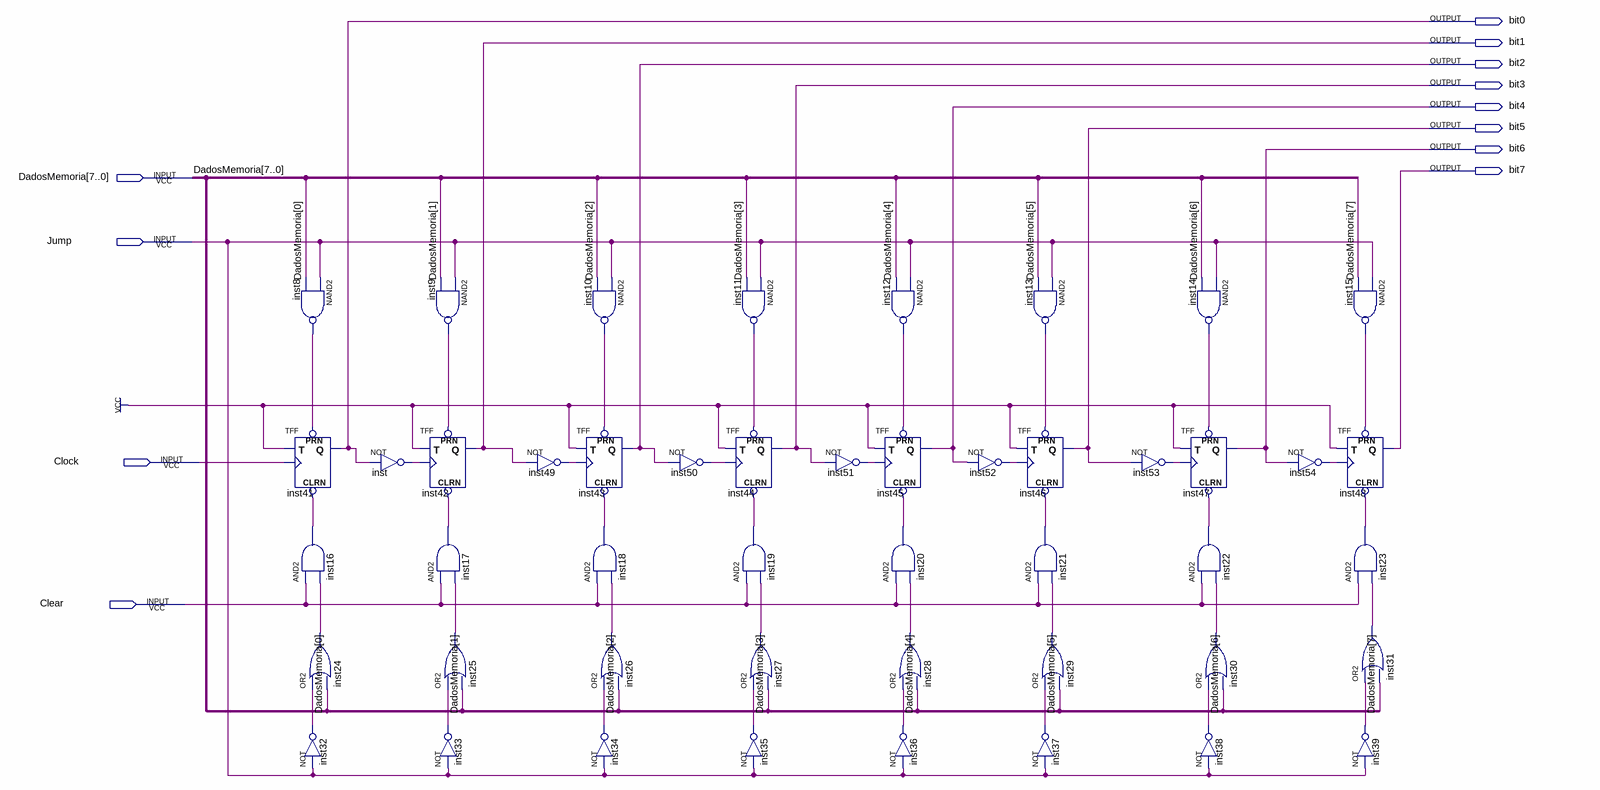
[diagram p0: schematic sheet]
// Quartus schematic contador_jump.bdf as structural Verilog: 47 symbols, 12 pins
module contador_jump (
  input  [7:0] DadosMemoria,
  input  Jump,
  input  Clock,
  input  Clear,
  output bit0,
  output bit1,
  output bit2,
  output bit3,
  output bit4,
  output bit5,
  output bit6,
  output bit7
);

  wire inst8_out, inst9_out, inst10_out, inst11_out, inst12_out, inst13_out, inst14_out, inst15_out,
       inst16_out, inst17_out, inst18_out, inst19_out, inst20_out, inst21_out, inst22_out, inst23_out,
       inst24_out, inst25_out, inst26_out, inst27_out, inst28_out, inst29_out, inst30_out, inst31_out,
       inst32_out, inst33_out, inst34_out, inst35_out, inst36_out, inst37_out, inst38_out, inst39_out,
       inst49_out, inst50_out, inst51_out, inst52_out, inst53_out, inst54_out, inst_out;

  nand inst8 (inst8_out, Jump, DadosMemoria[0]);
  TFF inst41 (.PRN(inst8_out), .CLRN(inst16_out), .T(1'b1), .CLK(Clock), .Q(bit0));
  and inst16 (inst16_out, Clear, inst24_out);
  or inst24 (inst24_out, inst32_out, DadosMemoria[0]);
  not inst32 (inst32_out, Jump);
  not inst (inst_out, bit0);
  nand inst9 (inst9_out, Jump, DadosMemoria[1]);
  TFF inst42 (.PRN(inst9_out), .CLRN(inst17_out), .T(1'b1), .CLK(inst_out), .Q(bit1));
  and inst17 (inst17_out, Clear, inst25_out);
  or inst25 (inst25_out, inst33_out, DadosMemoria[1]);
  not inst33 (inst33_out, Jump);
  not inst49 (inst49_out, bit1);
  nand inst10 (inst10_out, Jump, DadosMemoria[2]);
  TFF inst43 (.PRN(inst10_out), .CLRN(inst18_out), .T(1'b1), .CLK(inst49_out), .Q(bit2));
  and inst18 (inst18_out, Clear, inst26_out);
  or inst26 (inst26_out, inst34_out, DadosMemoria[2]);
  not inst34 (inst34_out, Jump);
  not inst50 (inst50_out, bit2);
  nand inst11 (inst11_out, Jump, DadosMemoria[3]);
  TFF inst44 (.PRN(inst11_out), .CLRN(inst19_out), .T(1'b1), .CLK(inst50_out), .Q(bit3));
  and inst19 (inst19_out, Clear, inst27_out);
  or inst27 (inst27_out, inst35_out, DadosMemoria[3]);
  not inst35 (inst35_out, Jump);
  not inst51 (inst51_out, bit3);
  nand inst12 (inst12_out, Jump, DadosMemoria[4]);
  TFF inst45 (.PRN(inst12_out), .CLRN(inst20_out), .T(1'b1), .CLK(inst51_out), .Q(bit4));
  and inst20 (inst20_out, Clear, inst28_out);
  or inst28 (inst28_out, inst36_out, DadosMemoria[4]);
  not inst36 (inst36_out, Jump);
  not inst52 (inst52_out, bit4);
  nand inst13 (inst13_out, Jump, DadosMemoria[5]);
  TFF inst46 (.PRN(inst13_out), .CLRN(inst21_out), .T(1'b1), .CLK(inst52_out), .Q(bit5));
  and inst21 (inst21_out, Clear, inst29_out);
  or inst29 (inst29_out, inst37_out, DadosMemoria[5]);
  not inst37 (inst37_out, Jump);
  not inst53 (inst53_out, bit5);
  nand inst14 (inst14_out, Jump, DadosMemoria[6]);
  TFF inst47 (.PRN(inst14_out), .CLRN(inst22_out), .T(1'b1), .CLK(inst53_out), .Q(bit6));
  and inst22 (inst22_out, Clear, inst30_out);
  or inst30 (inst30_out, inst38_out, DadosMemoria[6]);
  not inst38 (inst38_out, Jump);
  not inst54 (inst54_out, bit6);
  nand inst15 (inst15_out, Jump, DadosMemoria[7]);
  TFF inst48 (.PRN(inst15_out), .CLRN(inst23_out), .T(1'b1), .CLK(inst54_out), .Q(bit7));
  and inst23 (inst23_out, Clear, inst31_out);
  or inst31 (inst31_out, inst39_out, DadosMemoria[7]);
  not inst39 (inst39_out, Jump);
endmodule
